# EAGLE design CurrentSensingConverter (EAGLE 6.6.0)
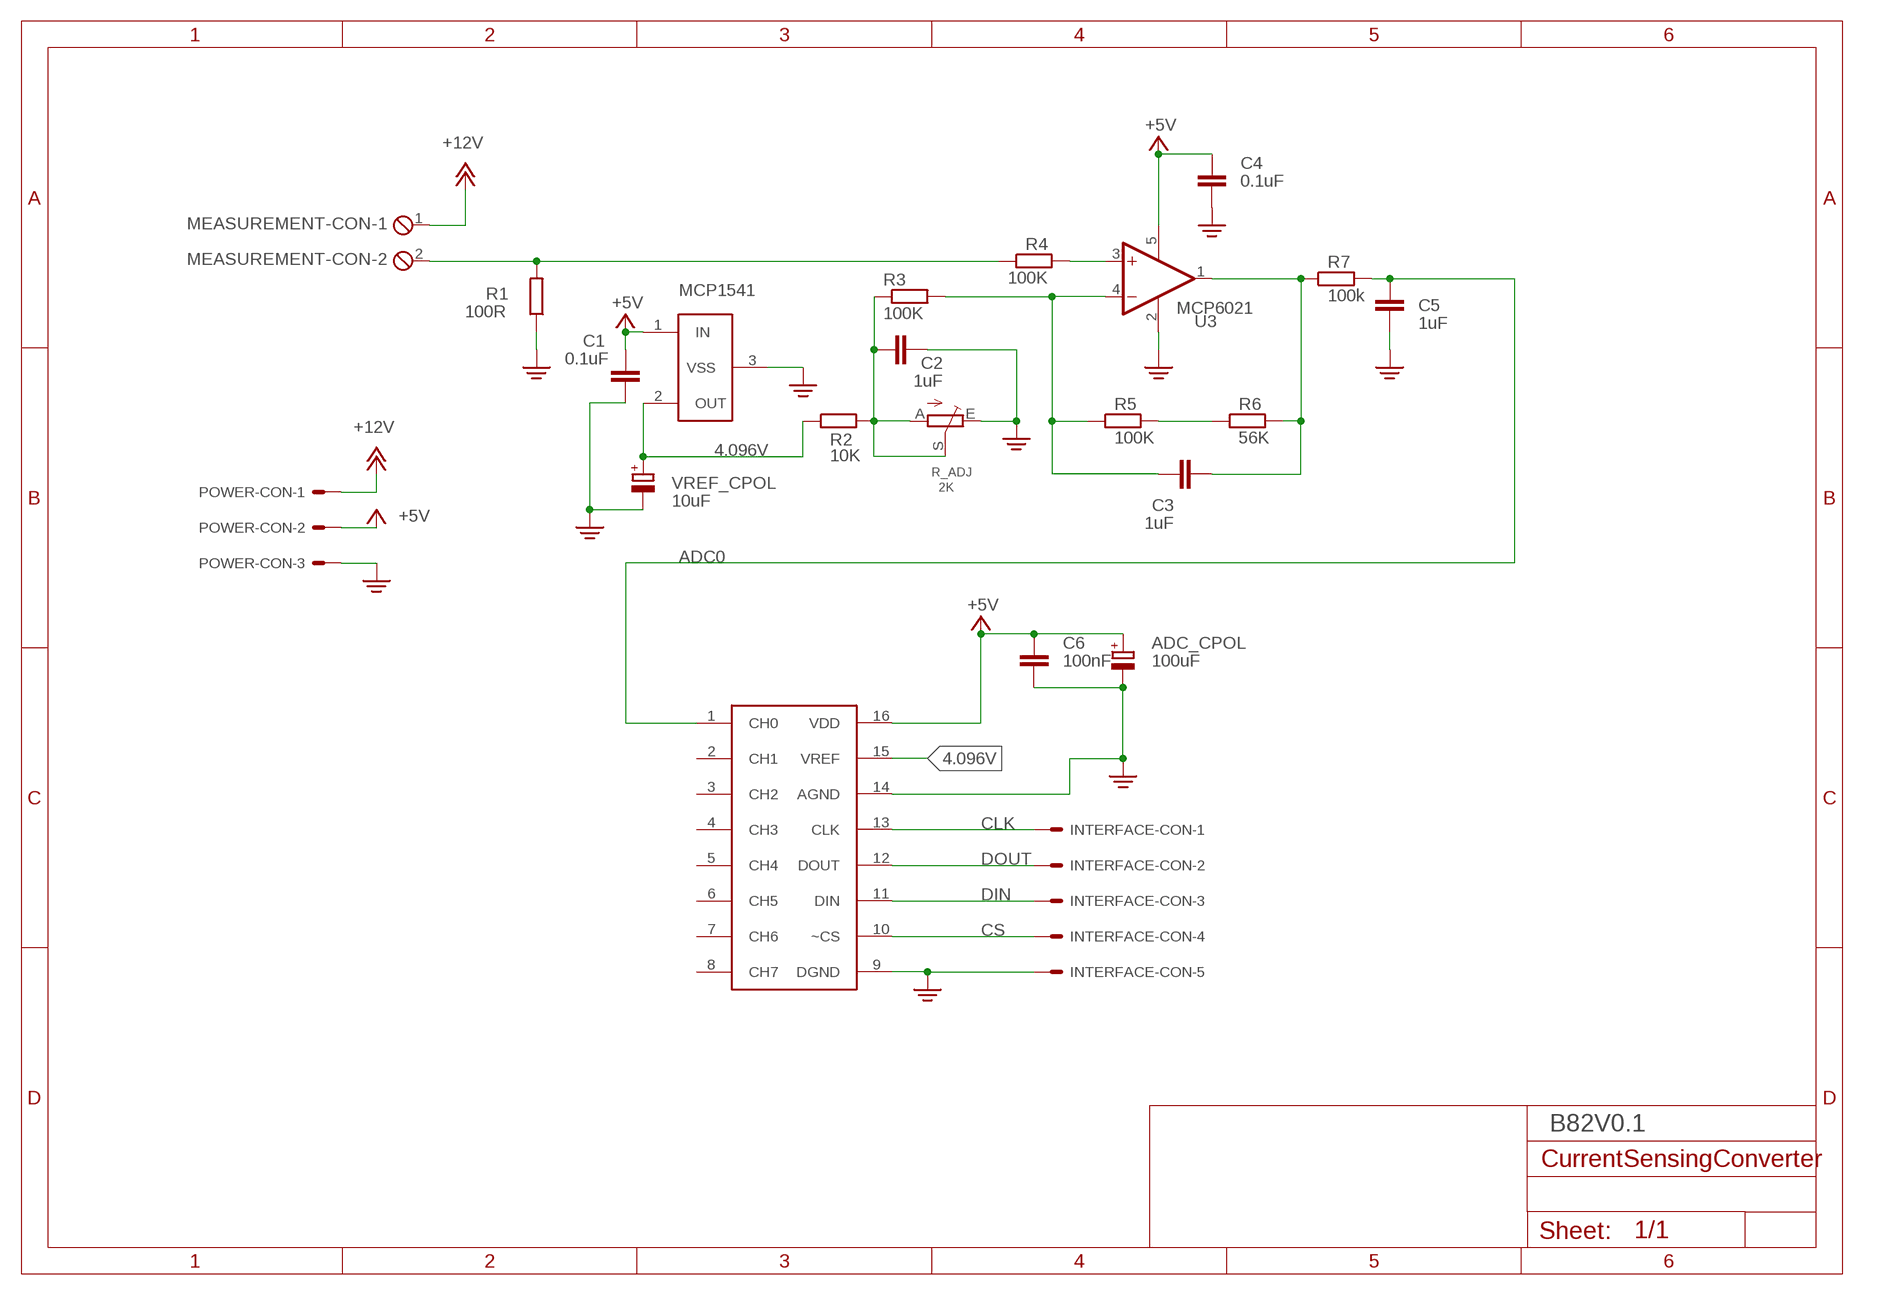
[diagram p0: schematic, sheet 1]

## Parts
ADC_CPOL  100uF  CPOL-EUD/7343-31R  [D/7343-31R]
C1  0.1uF  C-EUC1206  [C1206]
C2  1uF  C-EUC1206  [C1206]
C3  1uF  C-EUC1206  [C1206]
C4  0.1uF  C-EUC1206  [C1206]
C5  1uF  C-EUC1206  [C1206]
C6  100nF  C-EUC1206  [C1206]
INTERFACE-CON  22-05-7058-05  [7395-05]
MCP3208  MCP3208-CI/SI  [SO16]
MEASUREMENT-CON  MPT2  [2POL254]
POWER-CON  22-05-7038-03  [7395-03]
R1  100R  R-EU_R1206  [R1206]
R2  10K  R-EU_R1206  [R1206]
R3  100K  R-EU_R1206  [R1206]
R4  100K  R-EU_R1206  [R1206]
R5  100K  R-EU_R1206  [R1206]
R6  56K  R-EU_R1206  [R1206]
R7  100k  R-EU_R1206  [R1206]
R_ADJ  2K  TRIM_EU-B25P  [B25P]
U1  U1  MCP1541T-I/TT  [SOT23]
U3  MCP6021  MCP6021-SOT23  [SOT23-5L]
VREF_CPOL  10uF  CPOL-EUD/7343-31R  [D/7343-31R]

## Nets
4.096V: MCP3208.15(VREF) R2.1 U1.2(OUT) VREF_CPOL.+
+5V: ADC_CPOL.+ C1.1 C4.1 C6.1 MCP3208.16(VDD) POWER-CON.2 U1.1(IN) U3.5(V+)
+12V: MEASUREMENT-CON.1 POWER-CON.1
ADC0: C5.1 MCP3208.1(CH0) R7.2
CLK: INTERFACE-CON.1 MCP3208.13(CLK)
CS: INTERFACE-CON.4 MCP3208.10(~CS)
DIN: INTERFACE-CON.3 MCP3208.11(DIN)
DOUT: INTERFACE-CON.2 MCP3208.12(DOUT)
N$1: C3.1 R3.2 R5.1 U3.4(-IN)
N$2: R5.2 R6.1
N$3: C3.2 R6.2 R7.1 U3.1(OUT)
N$5: MEASUREMENT-CON.2 R1.2 R4.1
N$6: R4.2 U3.3(+IN)
N$7: C2.1 R2.2 R3.1 R_ADJ.A R_ADJ.S
PE: ADC_CPOL.- C1.2 C2.2 C4.2 C5.2 C6.2 INTERFACE-CON.5 MCP3208.9(DGND) MCP3208.14(AGND) POWER-CON.3 R1.1 R_ADJ.E U1.3(VSS) U3.2(V-) VREF_CPOL.-
Unconnected: MCP3208.2(CH1) MCP3208.3(CH2) MCP3208.4(CH3) MCP3208.5(CH4) MCP3208.6(CH5) MCP3208.7(CH6) MCP3208.8(CH7)

## Notes on the sheet
- B82V0.1

## Library data of the parts
ADC_CPOL VREF_CPOL = rcl:CPOL-EU: POLARIZED CAPACITOR, European symbol
C1-C6 = rcl:C-EU: CAPACITOR, European symbol
INTERFACE-CON = con-molex:22-?-05: CONNECTOR wire to board 2.54 mm (.1 inch) pitch header; OC_FARNELL: unknown; OC_NEWARK: unknown
MCP3208 = simon:MCP3208*: 2.7V 8-Channel 12-Bit A/D Converters with SPI Serial Interface
MEASUREMENT-CON = con-phoenix-254:MPT2: PHOENIX CONNECTOR; OC_FARNELL: unknown; OC_NEWARK: unknown
POWER-CON = con-molex:22-?-03: CONNECTOR wire to board 2.54 mm (.1 inch) pitch header; OC_FARNELL: unknown; OC_NEWARK: unknown
R1-R7 = resistor:R-EU_: RESISTOR, European symbol
R_ADJ = pot:TRIM_EU-: POTENTIOMETER
U1 = simon:MCP1541T-I/TT: Voltage Reference, Precision, Series - Fixed, MCP1541 Series, 4.096V, SOT-23-3
U3 = simon:MCP6021-SOT23: Created by Simon, 8May2023

## Board
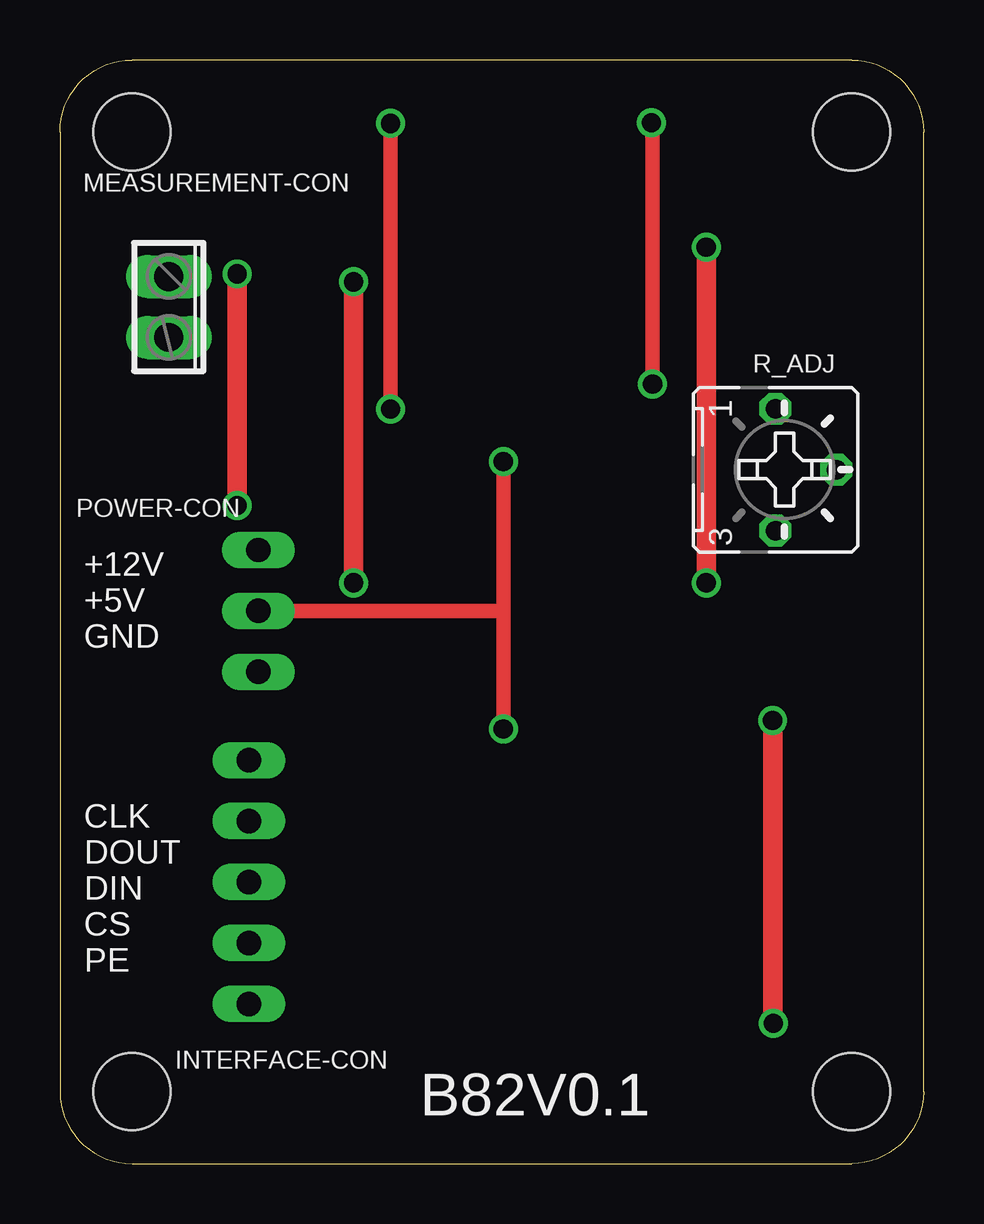
[diagram p1: board, top side]
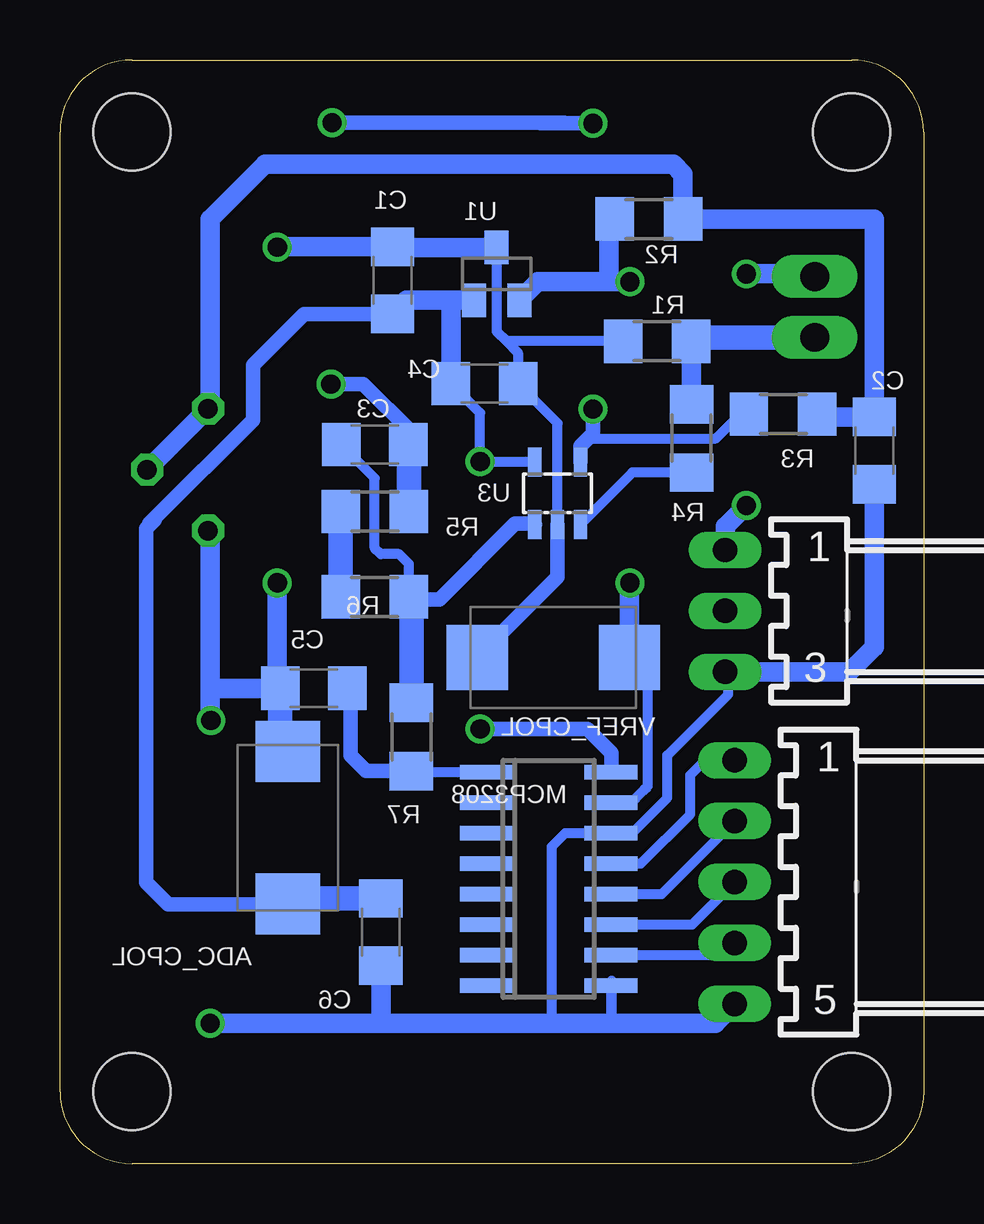
[diagram p2: board, bottom side, seen from below]

Size 36 x 46 mm. Coordinates in mm from the lower left corner, seen from the top.
Outline: 3,0 33,0 arc90 36,3 36,43 arc90 33,46 3,46 arc90 0,43 0,3 arc90 3,0
Copper layers (1*16): Top 0.035mm / dielectric 1.5mm / Bottom 0.035mm
Design rules "default *": minimum track width 10mil, minimum drill 24mil, track to track 8mil, track to pad 8mil, pad to pad 8mil, via to via 8mil, smd to smd 8mil, copper to edge 40mil, drill to drill 8mil, minimum pad ring 10mil, minimum via ring 8mil, stop-mask expansion 4mil, vias tented up to drill 0mil, thermal gap 10mil
Holes 3.2 mm at 3,3 3,43 33,3 33,43

### Footprints (pad centres in the part's own frame; a part is rotated, then mirrored left to right if it is on the bottom)
D/7343-31R = smd 2.55 x 2.7: + 3.175,0; - -3.175,0
C1206 = smd 1.6 x 1.8: 1 -1.4,0; 2 1.4,0
7395-05 = drill 1.016 long: 1 5.08,0; 2 2.54,0; 3 0,0; 4 -2.54,0; 5 -5.08,0
SO16 = smd 0.6 x 2.2: 1 -4.445,-2.6; 2 -3.175,-2.6; 3 -1.905,-2.6; 4 -0.635,-2.6; 5 0.635,-2.6; 6 1.905,-2.6; 7 3.175,-2.6; 8 4.445,-2.6; 9 4.445,2.6; 10 3.175,2.6; 11 1.905,2.6; 12 0.635,2.6; 13 -0.635,2.6; 14 -1.905,2.6; 15 -3.175,2.6; 16 -4.445,2.6
2POL254 = drill 1.2 long: 1 -1.27,0; 2 1.27,0
7395-03 = drill 1.016 long: 1 2.54,0; 2 0,0; 3 -2.54,0
R1206 = smd 1.6 x 1.803: 1 -1.422,0; 2 1.422,0
B25P = drill 0.813 octagon: A -2.54,0; E 2.54,0; S 0,2.54
SOT23 = smd 1 x 1.4: 1 -0.95,-1.1; 2 0.95,-1.1; 3 0,1.1
SOT23-5L = smd 0.55 x 1.2: 1 -0.95,-1.3; 2 0,-1.3; 3 0.95,-1.3; 4 0.95,1.3; 5 -0.95,1.3

### Placement (x,y rotation side)
ADC_CPOL  26.5,14 270 bottom
C1  22.13,36.81 90 bottom
C2  2.05,29.72 270 bottom
C3  22.88,29.97 180 bottom
C4  18.3,32.51 0 bottom
C5  25.42,19.81 180 bottom
C6  22.62,9.65 270 bottom
INTERFACE-CON  7.87,11.73 90 bottom
MCP3208  15.63,11.87 270 bottom
MEASUREMENT-CON  4.54,35.7 270 top
POWER-CON  8.27,23.03 90 bottom
R1  11.11,34.27 0 bottom
R2  11.45,39.37 0 bottom
R3  5.86,31.24 180 bottom
R4  9.67,30.23 270 bottom
R5  22.88,27.18 180 bottom
R6  22.88,23.62 0 bottom
R7  21.35,17.78 270 bottom
R_ADJ  29.83,28.92 270 top
U1  17.8,37.08 0 bottom
U3  15.26,27.94 0 bottom
VREF_CPOL  15.43,21.1 0 bottom

### Tracks (layer width: path | path; a pad name or v marks a point on that pad's centre or on a via)
4.096V  (via drill 0.8)
  Top 0.813: v12.23,24.21 v12.23,36.75
  Bottom 0.406: VREF_CPOL.+ 11.5,20.34 11.5,15.72 11.65,15.57 12.03,15.19 12.23,14.99 12.83,14.99 12.88,15.04 MCP3208.15
  Bottom 0.813: R2.1 13.12,39.37 13.12,36.83 13.05,36.75 | VREF_CPOL.+ 12.26,24.18 v12.23,24.21 | v12.23,36.75 13.05,36.75 | 13.05,36.75 16.08,36.75 U1.2
+5V  (via drill 0.8)
  Top 0.406: 18.43,23.03 18.48,23.09
  Top 0.61: v18.48,18.11 18.48,23.09 v18.48,29.26 | POWER-CON.2 18.43,23.03
  Bottom 0.406: 18.81,31.62 C4.1 18.48,31.29 v18.48,29.26 18.46,29.24 U3.5 16.23,29.26 | MCP3208.16 13.02,16.31 13.02,16.92
  Bottom 0.61: 32.27,26.67 32.05,26.9 | 32.05,26.9 27.96,30.99 27.96,33.27 25.82,35.41 C1.1 | 32.05,26.9 32.05,26.82 32.4,26.47 32.4,11.71 31.49,10.79 26.53,10.79 ADC_CPOL.+ | 13.02,16.46 13.02,16.92 13.02,17.12 14.01,18.11 v18.48,18.11
  Bottom 0.813: U1.1 19.57,35.98 | 19.57,35.98 21.56,35.98 C1.1 | C4.1 19.7,35.85 19.57,35.98 | 26.58,10.74 ADC_CPOL.+
  Bottom 1.016: C6.1 26.27,11.05 ADC_CPOL.+
+12V  (via drill 0.8)
  Top 0.813: v7.38,27.43 v7.38,37.08
  Bottom 0.813: POWER-CON.1 8.27,26.55 v7.38,27.43 | v7.38,37.08 4.65,37.08 MEASUREMENT-CON.1
ADC0
  Bottom 0.406: MCP3208.1 21.87,16.31 21.87,16.36
  Bottom 0.61: 21.25,16.46 R7.2 21.87,16.36 23.23,16.36 23.89,17.02 23.89,19.69 C5.1
CLK
  Bottom 0.406: INTERFACE-CON.1 7.92,16.76 9.16,16.76 9.73,16.2 9.73,14.55 11.78,12.5 MCP3208.13
CS
  Bottom 0.406: MCP3208.10 8.37,8.69 INTERFACE-CON.4
DIN
  Bottom 0.406: MCP3208.11 9.64,9.96 INTERFACE-CON.3
DOUT
  Bottom 0.406: MCP3208.12 10.91,11.23 INTERFACE-CON.2
N$1  (via drill 0.8)
  Top 0.61: v24.7,32.49 24.7,43.33 v24.65,43.38 | v13.78,31.45 v13.78,43.36
  Bottom 0.406: 20.97,30.48 C3.1 | R3.2 7.64,31.24 8.65,30.23 13.99,30.23 14.04,30.18
  Bottom 0.61: 20.97,30.48 21.35,30.48 23.36,32.49 v24.7,32.49 | v24.65,43.38 15.99,43.38 | 15.99,43.38 14.98,43.38 | v13.78,31.45 13.78,30.43 14.04,30.18 14.31,29.91 U3.4 | v13.78,43.36 15.97,43.36 15.99,43.38
  Bottom 1.016: R5.1 21.45,29.95 C3.1
N$2
  Bottom 1.016: R5.2 R6.1
N$3
  Bottom 0.406: R6.2 21.45,24.99 21.86,25.4 22.62,25.4 22.88,25.65 22.88,28.57 C3.2
  Bottom 0.61: 21.35,23.52 20.18,23.52 17.03,26.67 16.24,26.67 U3.1
  Bottom 1.016: R7.1 21.35,23.52 R6.2
N$5
  Bottom 0.813: R4.1 9.67,34.26 R1.2
  Bottom 1.016: MEASUREMENT-CON.2 9.52,34.43 R1.2
N$6
  Bottom 0.406: R4.2 12.14,28.8 U3.3
N$7
  Bottom 0.813: R_ADJ.S R_ADJ.A 29.73,31.56 29.73,39.37 27.45,41.66 10.43,41.66 10.02,41.25 R2.2 2.05,39.37 C2.1 4.31,31.12 R3.1
PE  (via drill 0.8)
  Top 0.813: v26.94,38.2 v26.94,24.21 | v29.71,18.47 29.71,5.87 v29.73,5.84
  Bottom 0.406: POWER-CON.3 8.14,20.37 8.14,19.56 10.68,17.02 10.68,15.24 12.15,13.77 MCP3208.14 14.95,13.77 15.51,13.21 15.51,6.1 15.26,5.84 | R1.1 17.37,34.27 | U1.3 17.8,34.7 17.37,34.27 | 17.37,34.27 16.91,33.81 C4.2 15.26,30.86 U3.2 | 13.01,7.62 13.01,6.15 | 13.01,6.15 13.01,5.99 13.16,5.84 | MCP3208.9 13.03,6.17 13.01,6.15
  Bottom 0.61: U3.2 15.26,24.45 VREF_CPOL.-
  Bottom 0.813: R_ADJ.E 29.73,26.29 29.73,19.99 | U1.3 22.1,38.18 C1.2 26.19,38.21 26.2,38.23 26.91,38.23 v26.94,38.2 | v29.73,5.84 22.62,5.84 | 22.62,5.84 15.26,5.84 13.16,5.84 8.68,5.84 INTERFACE-CON.5 | C6.2 22.62,5.84 | v26.94,24.21 26.94,19.94 C5.2 29.56,19.81 29.73,19.99 | 29.73,19.99 29.73,18.49 v29.71,18.47 | C2.2 2.05,21.54 3.09,20.5 POWER-CON.3
  Bottom 1.016: C5.2 26.82,17.49 ADC_CPOL.-

### Text on the board
tNames: +12V / +5V / GND | CLK / DOUT / DIN / CS / PE | B82V0.1